# Altium project CDB-helper.PrjPCB (part 1 of 2)
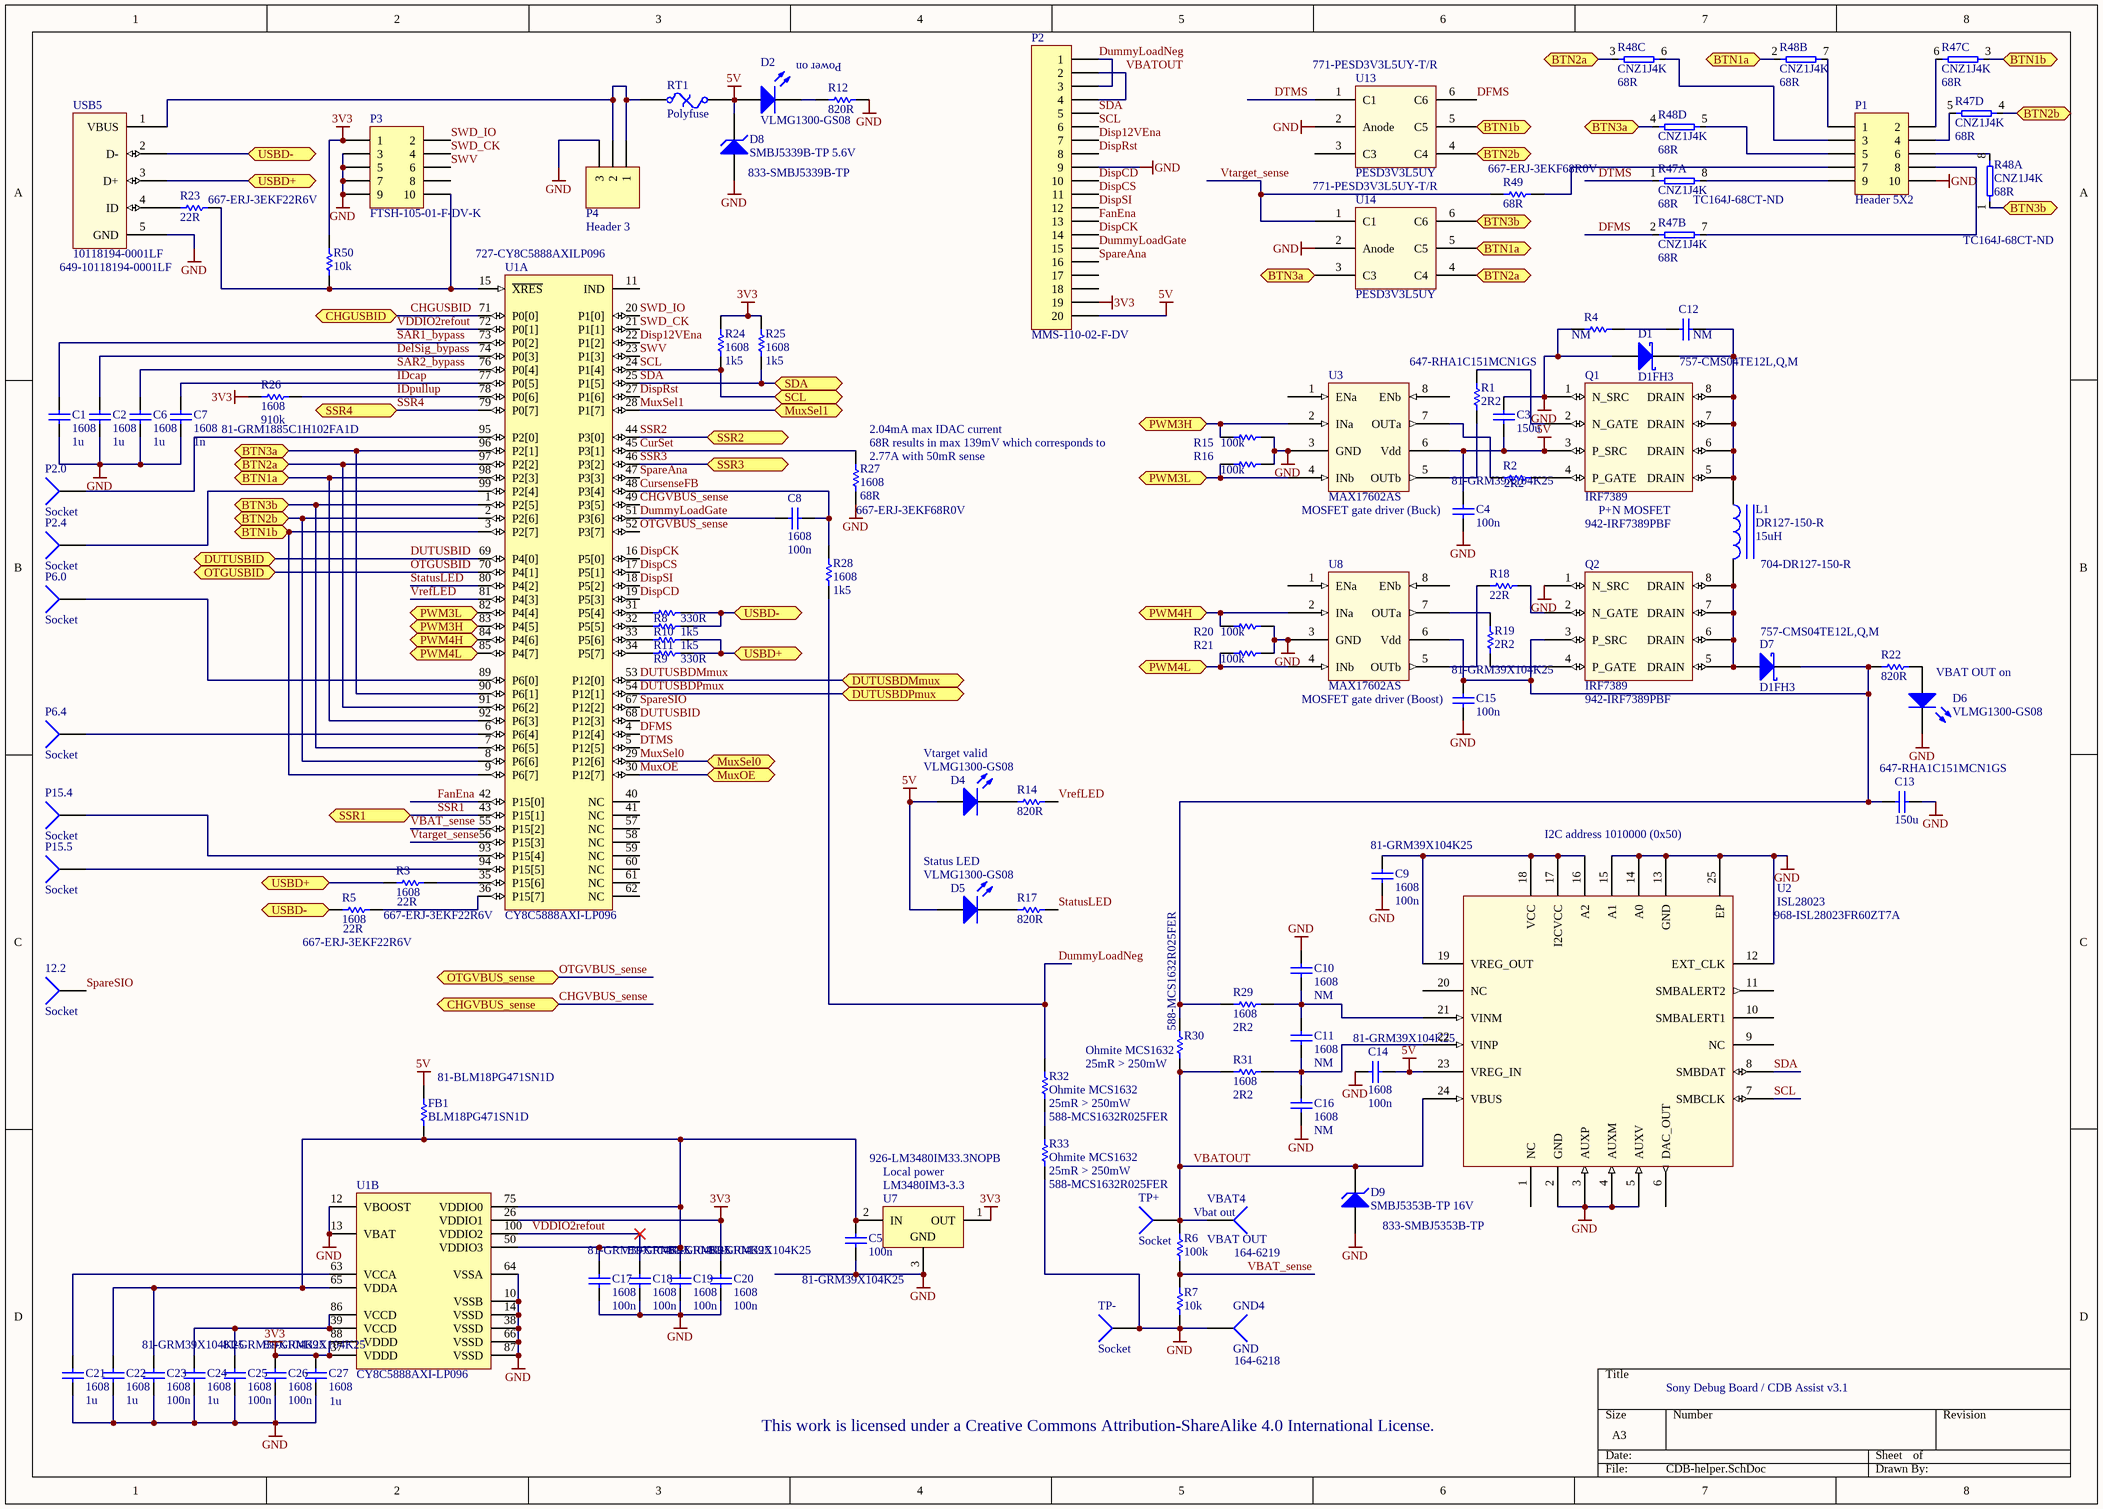
[diagram p0: CDB-helper.SchDoc]
2 sheets, 131 parts. Net scope: flat (ports and power ports of the same name join across sheets).
Board file: CDB-helper.PcbDoc
Sheets:
  CDB-helper.SchDoc
  USBSwitch.SchDoc

## Sheet CDB-helper.SchDoc
size A3; PageSetup: Record=PageOptions|CenterHorizontal=True|CenterVertical=True|PrintScale=1.42|XCorrection=1.00|YCorrection=1.00|PrintKind=0|BorderSize=5000000|LeftOffset=0|BottomOffset=0|Orientation=2|PaperLength=1000|PaperWidth=1000|Scale=100|PaperSource=7|PrintQuality=-4|MediaType=1|DitherType=10|PaperKind=Tabloid|PrintScaleMode=1

### Parts
12.2  Socket  [TP1.4mm]  (no BOM)
C1  1608  value 1u  [RESC1608N]
C2  1608  value 1u  [RESC1608N]
C3  Supplier Part Number 1: 647-RHA1C151MCN1GS  [CE-FS-8]  (hidden comment: 150u)
C4  value 100n  Supplier Part Number 1: 81-GRM39X104K25  [RESC1608N]  (hidden comment: 1608)
C5  value 100n  Supplier Part Number 1: 81-GRM39X104K25  [RESC1608N]  (hidden comment: 1608)
C6  1608  value 1u  [RESC1608N]
C7  1608  value 1n  Supplier Part Number 1: 81-GRM1885C1H102FA1D  [RESC1608N]
C8  1608  value 100n  [RESC1608N]
C9  1608  value 100n  Supplier Part Number 1: 81-GRM39X104K25  [RESC1608N]
C10  1608  value NM  [RESC1608N]
C11  1608  value NM  [RESC1608N]
C12  value NM  [RESC1608N]  (hidden comment: 1608)
C13  Supplier Part Number 1: 647-RHA1C151MCN1GS  [CE-FS-8]  (hidden comment: 150u)
C14  1608  value 100n  Supplier Part Number 1: 81-GRM39X104K25  [RESC1608N]
C15  value 100n  Supplier Part Number 1: 81-GRM39X104K25  [RESC1608N]  (hidden comment: 1608)
C16  1608  value NM  [RESC1608N]
C17  1608  value 100n  Supplier Part Number 1: 81-GRM39X104K25  [RESC1608N]
C18  1608  value 100n  Supplier Part Number 1: 81-GRM39X104K25  [RESC1608N]
C19  1608  value 100n  Supplier Part Number 1: 81-GRM39X104K25  [RESC1608N]
C20  1608  value 100n  Supplier Part Number 1: 81-GRM39X104K25  [RESC1608N]
C21  1608  value 1u  [RESC1608N]
C22  1608  value 1u  [RESC1608N]
C23  1608  value 100n  Supplier Part Number 1: 81-GRM39X104K25  [RESC1608N]
C24  1608  value 1u  [RESC1608N]
C25  1608  value 100n  Supplier Part Number 1: 81-GRM39X104K25  [RESC1608N]
C26  1608  value 100n  Supplier Part Number 1: 81-GRM39X104K25  [RESC1608N]
C27  1608  value 1u  [RESC1608N]
D1  D1FH3  Supplier Part Number 1: 757-CMS04TE12L,Q,M  [SMB]
D2  VLMG1300-GS08  [CAPC1608N]
D4  VLMG1300-GS08  [CAPC1608N]
D5  VLMG1300-GS08  [CAPC1608N]
D6  VLMG1300-GS08  [CAPC1608N]
D7  D1FH3  Supplier Part Number 1: 757-CMS04TE12L,Q,M  [SMB]
D8  SMBJ5339B-TP 5.6V  Supplier Part Number 1: 833-SMBJ5339B-TP  [SMB]
D9  SMBJ5353B-TP 16V  Supplier Part Number 1: 833-SMBJ5353B-TP  [SMB]
FB1  value BLM18PG471SN1D  Supplier Part Number 1: 81-BLM18PG471SN1D  [RESC1608N]  (hidden comment: 1608)
GND4  GND  Supplier Part Number 1: 164-6218  [4mmPlug]
L1  DR127-150-R  value 15uH  Supplier Part Number 1: 704-DR127-150-R  [DR127]
P1  Header 5X2  [HDR2X5]
P2  MMS-110-02-F-DV  [Samtec MMS 20-pin]
P2.0  Socket  [TP1.4mm]  (no BOM)
P2.4  Socket  [TP1.4mm]  (no BOM)
P3  FTSH-105-01-F-DV-K  [Samtech FTSH Cortex debug]
P4  Header 3  [HDR1X3]
P6.0  Socket  [TP1.4mm]  (no BOM)
P6.4  Socket  [TP1.4mm]  (no BOM)
P15.4  Socket  [TP1.4mm]  (no BOM)
P15.5  Socket  [TP1.4mm]  (no BOM)
Q1  IRF7389  Supplier Part Number 1: 942-IRF7389PBF  [SO-8_N]
Q2  IRF7389  Supplier Part Number 1: 942-IRF7389PBF  [SO-8_N]
R1  value 2R2  [RESC1608N]  (hidden comment: 1608)
R2  value 2R2  [RESC1608N]  (hidden comment: 1608)
R3  1608  value 22R  Supplier Part Number 1: 667-ERJ-3EKF22R6V  [RESC1608N]
R4  value NM  [RESC1608N]  (hidden comment: 1608)
R5  1608  value 22R  Supplier Part Number 1: 667-ERJ-3EKF22R6V  [RESC1608N]
R6  value 100k  [RESC1608N]  (hidden comment: 1608)
R7  value 10k  [RESC1608N]  (hidden comment: 1608)
R8  value 330R  [RESC1608N]  (hidden comment: 1608)
R9  value 330R  [RESC1608N]  (hidden comment: 1608)
R10  value 1k5  [RESC1608N]  (hidden comment: 1608)
R11  value 1k5  [RESC1608N]  (hidden comment: 1608)
R12  value 820R  [RESC1608N]  (hidden comment: 1608)
R14  value 820R  [RESC1608N]  (hidden comment: 1608)
R15  value 100k  [RESC1608N]  (hidden comment: 1608)
R16  value 100k  [RESC1608N]  (hidden comment: 1608)
R17  value 820R  [RESC1608N]  (hidden comment: 1608)
R18  value 22R  [RESC1608N]  (hidden comment: 1608)
R19  value 2R2  [RESC1608N]  (hidden comment: 1608)
R20  value 100k  [RESC1608N]  (hidden comment: 1608)
R21  value 100k  [RESC1608N]  (hidden comment: 1608)
R22  value 820R  [RESC1608N]  (hidden comment: 1608)
R23  value 22R  Supplier Part Number 1: 667-ERJ-3EKF22R6V  [RESC1608N]  (hidden comment: 1608)
R24  1608  value 1k5  [RESC1608N]
R25  1608  value 1k5  [RESC1608N]
R26  1608  value 910k  [RESC1608N]
R27  1608  value 68R  Supplier Part Number 1: 667-ERJ-3EKF68R0V  [RESC1608N]
R28  1608  value 1k5  [RESC1608N]
R29  1608  value 2R2  [RESC1608N]
R30  Ohmite MCS1632  value 25mR > 250mW  Supplier Part Number 1: 588-MCS1632R025FER  [RESC3216X06N]
R31  1608  value 2R2  [RESC1608N]
R32  Ohmite MCS1632  value 25mR > 250mW  Supplier Part Number 1: 588-MCS1632R025FER  [RESC3216X06N]
R33  Ohmite MCS1632  value 25mR > 250mW  Supplier Part Number 1: 588-MCS1632R025FER  [RESC3216X06N]
R47  CNZ1J4K  value 68R  Supplier Part Number 1: TC164J-68CT-ND  [CN1J4-3D]  (parts A,B,C,D of 4)
R48  CNZ1J4K  value 68R  Supplier Part Number 1: TC164J-68CT-ND  [CN1J4-3D]  (parts A,B,C,D of 4)
R49  value 68R  Supplier Part Number 1: 667-ERJ-3EKF68R0V  [RESC1608N]  (hidden comment: 1608)
R50  value 10k  [RESC1608N]  (hidden comment: 1608)
RT1  Polyfuse  [RESC4532N]
TP+  Socket  [PIN1]  (no BOM)
TP-  Socket  [PIN1]  (no BOM)
U1  CY8C5888AXI-LP096  Supplier Part Number 1: 727-CY8C5888AXILP096  [CYP-AX100_N]  (parts A,B of 2)
U2  ISL28023  Supplier Part Number 1: 968-ISL28023FR60ZT7A  [ISL28023]
U3  MAX17602AS  [NSO8_N]
U7  LM3480IM3-3.3  Supplier Part Number 1: 926-LM3480IM33.3NOPB  [MF03A_L]
U8  MAX17602AS  [NSO8_N]
U13  PESD3V3L5UY  Supplier Part Number 1: 771-PESD3V3L5UY-T/R  [PESD3V3L5UY]
U14  PESD3V3L5UY  Supplier Part Number 1: 771-PESD3V3L5UY-T/R  [PESD3V3L5UY]
USB5  10118194-0001LF  Supplier Part Number 1: 649-10118194-0001LF  [uUSB]
VBAT4  VBAT OUT  Supplier Part Number 1: 164-6219  [4mmPlug]

### Ports
BTN1a, BTN1b, BTN2a, BTN2b, BTN3a, BTN3b, CHGUSBID, CHGVBUS_sense, DUTUSBDMmux, DUTUSBDPmux, DUTUSBID, MuxOE, MuxSel0, MuxSel1, OTGUSBID, OTGVBUS_sense, PWM3H, PWM3L, PWM4H, PWM4L, SCL, SDA, SSR1, SSR2, SSR3, SSR4, USBD+, USBD-

### Nets
3V3: C20.1 C26.1 C27.1 P2.19 P3.1 R24.1 R25.1 R26.1 R50.2 U1.26(VDDIO1) U1.37(VDDD) U1.88(VDDD) U7.1(OUT)
5V: C3.1 C4.2 C14.2 D2.1(A) D4.1(A) D5.1(A) D8.2(K) FB1.2 P2.20 Q1.3(P_SRC) RT1.2 U2.23(VREG_IN) U3.6(Vdd)
GND: C1.2 C2.2 C3.2 C4.1 C5.2 C6.2 C7.2 C9.1 C10.1 C13.2 C14.1 C15.1 C16.2 C17.2 C18.2 C19.2 C20.2 C21.2 C22.2 C23.2 C24.2 C25.2 C26.2 C27.2 D1.1(A) D6.2(K) D8.1(A) D9.1(A) GND4.1 P1.10 P2.9 P3.3 P3.5 P3.7 P3.9 P4.3 Q1.1(N_SRC) Q2.1(N_SRC) R4.1 R7.1 R12.2 R15.2 R16.1 R20.2 R21.1 R27.2 R33.1 TP-.1 U1.10(VSSB) U1.12(VBOOST) U1.13(VBAT) U1.14(VSSD) U1.38(VSSD) U1.64(VSSA) U1.66(VSSD) U1.87(VSSD) U2.2(GND) U2.3(AUXP) U2.4(AUXM) U2.5(AUXV) U2.12(EXT_CLK) U2.13(GND) U2.14(A0) U2.15(A1) U2.25(EP) U3.3(GND) U7.3(GND) U8.3(GND) U13.2(Anode) U14.2(Anode) USB5.5(GND)
CHGUSBID: U1.71(P0[0]) ; port CHGUSBID
CHGVBUS_sense: U1.49(P3[5]) ; port CHGVBUS_sense
CursenseFB: C8.2 R28.1 U1.48(P3[4])
CurSet: R27.1 U1.45(P3[1])
DelSig_bypass: C2.1 U1.74(P0[3])
DFMS: R47.2 U1.4(P12[4]) U13.6(C6)
Disp12VEna: P2.7 U1.22(P1[2])
DispCD: P2.10 U1.19(P5[3])
DispCK: P2.14 U1.16(P5[0])
DispCS: P2.11 U1.17(P5[1])
DispRst: P2.8 U1.27(P1[6])
DispSI: P2.12 U1.18(P5[2])
DTMS: R47.1 U1.5(P12[5]) U13.1(C1)
DummyLoadGate: C8.1 P2.15 U1.51(P3[6])
DummyLoadNeg: P2.1 P2.3 R28.2 R32.1
DUTUSBDMmux: U1.53(P12[0]) ; port DUTUSBDMmux
DUTUSBDPmux: U1.54(P12[1]) ; port DUTUSBDPmux
DUTUSBID: U1.68(P12[3]) U1.69(P4[0]) ; port DUTUSBID
FanEna: P2.13 U1.42(P15[0])
IDcap: C7.1 U1.77(P0[5])
IDpullup: R26.2 U1.78(P0[6])
MuxOE: U1.30(P12[7]) ; port MuxOE
MuxSel0: U1.29(P12[6]) ; port MuxSel0
MuxSel1: U1.28(P1[7]) ; port MuxSel1
OTGUSBID: U1.70(P4[1]) ; port OTGUSBID
OTGVBUS_sense: U1.52(P3[7]) ; port OTGVBUS_sense
SAR1_bypass: C1.1 U1.73(P0[2])
SAR2_bypass: C6.1 U1.76(P0[4])
SCL: P2.6 R24.2 U1.24(P1[4]) U2.7(SMBCLK) ; port SCL
SDA: P2.5 R25.2 U1.25(P1[5]) U2.8(SMBDAT) ; port SDA
SpareAna: P2.16 U1.47(P3[3])
SpareSIO: 12.2.1 U1.67(P12[2])
SSR1: U1.43(P15[1]) ; port SSR1
SSR2: U1.44(P3[0]) ; port SSR2
SSR3: U1.46(P3[2]) ; port SSR3
SSR4: U1.79(P0[7]) ; port SSR4
StatusLED: R17.2 U1.80(P4[2])
SWD_CK: P3.4 U1.21(P1[1])
SWD_IO: P3.2 U1.20(P1[0])
SWV: P3.6 U1.23(P1[3])
VBAT_sense: R6.1 R7.2 U1.55(P15[2])
VBATOUT: D9.2(K) P2.2 P2.4 R6.2 R30.2 R31.2 TP+.1 U2.24(VBUS) VBAT4.1
VDDIO2refout: C18.1 U1.72(P0[1]) U1.100(VDDIO2)
VrefLED: R14.2 U1.81(P4[3])
Vtarget_sense: R49.2 U1.56(P15[3]) U14.1(C1)
NetC5_1: C5.1 C17.1 C19.1 C22.1 C23.1 FB1.1 U1.50(VDDIO3) U1.65(VDDA) U1.75(VDDIO0) U7.2(IN)
NetC9_2: C9.2 U2.16(A2) U2.17(I2CVCC) U2.18(VCC) U2.19(VREG_OUT)
NetC10_2: C10.2 C11.1 R29.1 U2.21(VINM)
NetC11_2: C11.2 C16.1 R31.1 U2.22(VINP)
NetC12_1: C12.1 D1.2(K) L1.1 Q1.5(DRAIN) Q1.6(DRAIN) Q1.7(DRAIN) Q1.8(DRAIN)
NetC12_2: C12.2 R4.2
NetC13_1: C13.1 C15.2 D7.2(K) Q2.3(P_SRC) R22.1 R29.2 R30.1 U8.6(Vdd)
NetC21_1: C21.1 U1.63(VCCA)
NetC24_1: C24.1 C25.1 U1.39(VCCD) U1.86(VCCD)
NetD2_2: D2.2(K) R12.1
NetD4_2: D4.2(K) R14.1
NetD5_2: D5.2(K) R17.1
NetD6_1: D6.1(A) R22.2
NetD7_1: D7.1(A) L1.2 Q2.5(DRAIN) Q2.6(DRAIN) Q2.7(DRAIN) Q2.8(DRAIN)
NetP1_1: P1.1 R48.7
NetP1_2: P1.2 R47.6
NetP1_3: P1.3 R48.6
NetP1_4: P1.4 R47.5
NetP1_5: P1.5 R48.5
NetP1_6: P1.6 R48.8
NetP1_7: P1.7 R49.1
NetP1_8: P1.8 R47.7
NetP1_9: P1.9 R47.8
NetP2.0_1: P2.0.1 U1.95(P2[0])
NetP2.4_1: P2.4.1 U1.99(P2[4])
NetP3_10: P3.10 R23.1 R50.1 U1.15(~{XRES})
NetP4_1: P4.1 P4.2 RT1.1 USB5.1(VBUS)
NetP6.0_1: P6.0.1 U1.89(P6[0])
NetP6.4_1: P6.4.1 U1.6(P6[4])
NetP15.4_1: P15.4.1 U1.93(P15[4])
NetP15.5_1: P15.5.1 U1.94(P15[5])
NetQ1_2: Q1.2(N_GATE) R1.1
NetQ1_4: Q1.4(P_GATE) R2.2
NetQ2_2: Q2.2(N_GATE) R18.2
NetQ2_4: Q2.4(P_GATE) R19.1
NetR1_2: R1.2 U3.5(OUTb)
NetR2_1: R2.1 U3.7(OUTa)
NetR3_1: R3.1 U1.35(P15[6])
NetR3_2: R3.2 R9.1 R11.1 USB5.3(D+) ; port USBD+
NetR5_1: R5.1 U1.36(P15[7])
NetR5_2: R5.2 R8.1 R10.1 USB5.2(D-) ; port USBD-
NetR8_2: R8.2 U1.31(P5[4])
NetR9_2: R9.2 U1.34(P5[7])
NetR10_2: R10.2 U1.32(P5[5])
NetR11_2: R11.2 U1.33(P5[6])
NetR15_1: R15.1 U1.83(P4[5]) U3.2(INa) ; port PWM3H
NetR16_2: R16.2 U1.82(P4[4]) U3.4(INb) ; port PWM3L
NetR18_1: R18.1 U8.5(OUTb)
NetR19_2: R19.2 U8.7(OUTa)
NetR20_1: R20.1 U1.84(P4[6]) U8.2(INa) ; port PWM4H
NetR21_2: R21.2 U1.85(P4[7]) U8.4(INb) ; port PWM4L
NetR23_2: R23.2 USB5.4(ID)
NetR32_2: R32.2 R33.2
NetR47_3: R47.3 U1.3(P2[7]) U1.9(P6[7]) U13.5(C5) ; port BTN1b
NetR47_4: R47.4 U1.2(P2[6]) U1.8(P6[6]) U13.4(C4) ; port BTN2b
NetR48_1: R48.1 U1.1(P2[5]) U1.7(P6[5]) U14.6(C6) ; port BTN3b
NetR48_2: R48.2 U1.92(P6[3]) U1.98(P2[3]) U14.5(C5) ; port BTN1a
NetR48_3: R48.3 U1.91(P6[2]) U1.97(P2[2]) U14.4(C4) ; port BTN2a
NetR48_4: R48.4 U1.90(P6[1]) U1.96(P2[1]) U14.3(C3) ; port BTN3a

Not connected (* = marked no-connect by the designer): P2 17 18; P3 8; U1 11(IND) 40(NC) 41(NC) 57(NC) 58(NC) 59(NC) 60(NC) 61(NC) 62(NC); U2 1(NC) 6(DAC_OUT) 9(NC) 10(SMBALERT1) 11(SMBALERT2) 20(NC); U3 1(ENa) 8(ENb); U8 1(ENa) 8(ENb); U13 3(C3)

### Notes on the sheet
- Power on
- (near R27) 2.04mA max IDAC current
- (near R27) 68R results in max 139mV which corresponds to
- (near R27) 2.77A with 50mR sense
- (near C4) MOSFET gate driver (Buck)
- (near Q1) P+N MOSFET
- (near C15) MOSFET gate driver (Boost)
- VBAT OUT on
- Vtarget valid
- I2C address 1010000 (0x50)
- Status LED
- Local power
- (near VBAT4) Vbat out
- Sony Debug Board / CDB Assist v3.1
- This work is licensed under a Creative Commons Attribution-ShareAlike 4.0 International License.

### Library data of the parts
C1 C2 C6 C8 C10 C11 C16 C21 C22 C24 C27 = Cap Semi: Capacitor (Semiconductor SIM Model); Published: 8-Jun-2000; LatestRevisionDate: 29-May-2009; LatestRevisionNote: IPC-7351 Footprint Added.; PackageReference: C1206; Publisher: Altium Limited; PackageDescription: Chip Capacitor
C3 C13 = Cap: Capacitor; Manufacturer: Nichicon; Manufacturer Part Number: RHA1C151MCN1GS; Capacitance: 150 uF; Tolerance: 20 %; Voltage Rating DC: 16 V; ESR: 22 mOhms; Leakage Current: 700 uA; Case Diameter: 8 mm; Case Length: 6.7 mm; Dissipation Factor DF: 0.12; Ripple Current: 3.22 A; Published: 8-Jun-2000; LatestRevisionDate: 17-Jul-2002; LatestRevisionNote: Re-released for DXP Platform.; PackageReference: RAD-0.3; Publisher: Altium Limited; PackageDescription: Radial Cap, Thru-Hole; 2 Leads; 0.3 in Pin Spacing; Value: 150u; Supplier 1: Mouser; RoHS: RoHS Compliant; Category: Aluminum Organic Polymer Capacitors; Stock 1: 12231; Pricing 1: 1=1.30, 10=0.878, 100=0.578, 500=0.520, 1000=0.359, 2000=0.335, 5000=0.318, 10000=0.307, 25000=0.281 (USD); Packaging: Reel; Product: Organic Polymer Aluminum - SMD Capacitors; Series: HA; Termination Style: SMD/SMT; Brand: Nichicon; Maximum Operating Temperature: + 105 C; Minimum Operating Temperature: - 55 C; Product Category: Functional Polymer Capacitors Radial/SMD; Product Type: Can; Standard Pack Qty: 1000; Tradename: FPCAP; RoHS - Mouser: Y; Minimum Order Quantity: 1; Reeling: True; ComponentLink1URL: http://www.mouser.com/ds/2/293/2009fpcap_catalog_hsha-28192.pdf; ComponentLink1Description: http://www.mouser.com/ds/2/293/2009fpcap_catalog_hsha-28192.pdf
C4 C5 C15 = Cap: Capacitor; Manufacturer: Murata Electronics; Manufacturer Part Number: GRM188R71E104KA01D; Capacitance: 0.1 uF; Tolerance: 10 %; Type: General Purpose MLCC; Voltage Rating DC: 25 V; Case Height: 0.8 mm; Case Length: 1.6 mm; Dielectric: X7R; Temperature Coefficient / Code: +/- 15 %; Published: 8-Jun-2000; LatestRevisionDate: 17-Jul-2002; LatestRevisionNote: Re-released for DXP Platform.; PackageReference: RAD-0.3; Publisher: Altium Limited; PackageDescription: Radial Cap, Thru-Hole; 2 Leads; 0.3 in Pin Spacing; Supplier 1: Mouser; RoHS: RoHS Compliant; Category: Multilayer Ceramic Capacitors MLCC - SMD/SMT; Stock 1: 1414567; Pricing 1: 1=0.100, 10=0.011, 100=0.007, 1000=0.005, 4000=0.004, 48000=0.003 (USD); Operating Temperature Range: - 55 C to + 125 C; Package / Case: 0603 (1608 metric); Packaging: Reel; Product: General Type MLCCs; Series: GRM; Termination Style: SMD/SMT; Brand: Murata Electronics; Case Code - in: 0603; Case Code - mm: 1608; Case Width: 0.8 mm; Maximum Operating Temperature: + 125 C; Minimum Operating Temperature: - 55 C; Product Category: Low & Medium Capacitance SMD Ceramic Chip Capacitors; Standard Pack Qty: 4000; RoHS - Mouser: Y; Minimum Order Quantity: 1; Reeling: True; ComponentLink1URL: http://www.murata.com/products/catalog/pdf/c02e.pdf; ComponentLink1Description: http://www.murata.com/products/catalog/pdf/c02e.pdf
C7 = Cap Semi: Capacitor (Semiconductor SIM Model); Manufacturer: Murata Electronics; Manufacturer Part Number: GRM1885C1H102FA01D; Capacitance: 1000 pF; Tolerance: 1 %; Type: General Purpose MLCC; Voltage Rating DC: 50 V; Case Height: 0.8 mm; Case Length: 1.6 mm; Dielectric: C0G (NP0); Temperature Coefficient / Code: +/- 30 PPM / C; Published: 8-Jun-2000; LatestRevisionDate: 29-May-2009; LatestRevisionNote: IPC-7351 Footprint Added.; PackageReference: C1206; Publisher: Altium Limited; PackageDescription: Chip Capacitor; Supplier 1: Mouser; RoHS: RoHS Compliant; Category: Multilayer Ceramic Capacitors MLCC - SMD/SMT; Stock 1: 172542; Pricing 1: 1=0.180, 10=0.074, 100=0.043, 1000=0.035, 4000=0.027, 8000=0.024, 24000=0.023, 48000=0.021, 100000=0.018 (USD); Operating Temperature Range: - 55 C to + 125 C; Package / Case: 0603 (1608 metric); Packaging: Reel; Product: General Type MLCCs; Series: GRM; Termination Style: SMD/SMT; Brand: Murata Electronics; Case Code - in: 0603; Case Code - mm: 1608; Case Width: 0.8 mm; Maximum Operating Temperature: + 125 C; Minimum Operating Temperature: - 55 C; Product Category: Low & Medium Capacitance SMD Ceramic Chip Capacitors; Standard Pack Qty: 4000; RoHS - Mouser: Y; Minimum Order Quantity: 1; Reeling: True; ComponentLink1URL: http://www.murata.com/products/catalog/pdf/c02e.pdf; ComponentLink1Description: http://www.murata.com/products/catalog/pdf/c02e.pdf
C9 C14 C17-C20 C23 C25 C26 = Cap Semi: Capacitor (Semiconductor SIM Model); Manufacturer: Murata Electronics; Manufacturer Part Number: GRM188R71E104KA01D; Capacitance: 0.1 uF; Tolerance: 10 %; Type: General Purpose MLCC; Voltage Rating DC: 25 V; Case Height: 0.8 mm; Case Length: 1.6 mm; Dielectric: X7R; Temperature Coefficient / Code: +/- 15 %; Published: 8-Jun-2000; LatestRevisionDate: 29-May-2009; LatestRevisionNote: IPC-7351 Footprint Added.; PackageReference: C1206; Publisher: Altium Limited; PackageDescription: Chip Capacitor; Supplier 1: Mouser; RoHS: RoHS Compliant; Category: Multilayer Ceramic Capacitors MLCC - SMD/SMT; Stock 1: 1414567; Pricing 1: 1=0.100, 10=0.011, 100=0.007, 1000=0.005, 4000=0.004, 48000=0.003 (USD); Operating Temperature Range: - 55 C to + 125 C; Package / Case: 0603 (1608 metric); Packaging: Reel; Product: General Type MLCCs; Series: GRM; Termination Style: SMD/SMT; Brand: Murata Electronics; Case Code - in: 0603; Case Code - mm: 1608; Case Width: 0.8 mm; Maximum Operating Temperature: + 125 C; Minimum Operating Temperature: - 55 C; Product Category: Low & Medium Capacitance SMD Ceramic Chip Capacitors; Standard Pack Qty: 4000; RoHS - Mouser: Y; Minimum Order Quantity: 1; Reeling: True; ComponentLink1URL: http://www.murata.com/products/catalog/pdf/c02e.pdf; ComponentLink1Description: http://www.murata.com/products/catalog/pdf/c02e.pdf
C12 = Cap: Capacitor; Published: 8-Jun-2000; LatestRevisionDate: 17-Jul-2002; LatestRevisionNote: Re-released for DXP Platform.; PackageReference: RAD-0.3; Publisher: Altium Limited; PackageDescription: Radial Cap, Thru-Hole; 2 Leads; 0.3 in Pin Spacing
D1 D7 = D Schottky: Schottky Diode; Manufacturer: Toshiba; Manufacturer Part Number: CMS04(TE12L,Q,M); Configuration: Single; If - Forward Current: 5 A; Ifsm - Forward Surge Current: 70 A; Ir - Reverse Current: 8000 uA; Vf - Forward Voltage: 0.37 V; Vrrm - Repetitive Reverse Voltage: 30 V; Published: 8-Jun-2000; LatestRevisionDate: 17-Jul-2002; LatestRevisionNote: Re-released for DXP Platform.; PackageReference: SMB; Publisher: Altium Limited; PackageDescription: DO-214-AA/SMB; 2 C-Bend Leads; Body 5.3 x 3.6 mm, inc. leads (LxW); Code_JEDEC: DO-214-AA; Supplier 1: Mouser; RoHS: RoHS Compliant; Category: Schottky Diodes & Rectifiers; Stock 1: 14859; Pricing 1: 1=0.820, 10=0.640, 100=0.414, 1000=0.331, 3000=0.271, 9000=0.261, 24000=0.251, 45000=0.247 (USD); Package / Case: M-FLAT; Packaging: Reel; Product: Schottky Rectifiers; Technology: Si; Brand: Toshiba; Mounting Style: SMD/SMT; Maximum Operating Temperature: + 125 C; Minimum Operating Temperature: - 40 C; Product Category: Diodes - Schottky; Standard Pack Qty: 3000; RoHS - Mouser: Y; Minimum Order Quantity: 1; Reeling: True; ComponentLink1URL: http://toshiba.semicon-storage.com/info/docget.jsp?did=3133&prodName=CMS04; ComponentLink1Description: http://toshiba.semicon-storage.com/info/docget.jsp?did=3133&prodName=CMS04
D2 D4-D6 = LED2: Typical RED, GREEN, YELLOW, AMBER GaAs LED; pin to pad: 1>2 2>1; Published: 8-Jun-2000; LatestRevisionDate: 17-Jul-2002; LatestRevisionNote: Re-released for DXP Platform.; PackageVersion: Feb-2002; PackageReference: 3.2X1.6X1.1; Publisher: Altium Limited; PackageDescription: SM LED; 2 Flat Leads; PN_DigiKey: VLMG1300-GS08CT-ND
D8 = D Zener: Zener Diode; Manufacturer: Micro Commercial Components (MCC); Configuration: Single; Voltage Regulation Accuracy: 250 mV; Zener Current: 865 mA; Maximum Reverse Leakage Current: 1 uA; Pd - Power Dissipation: 5 W; Voltage Tolerance: 5 %; Zz - Zener Impedance: 1 Ohms; Published: 8-Jun-2000; LatestRevisionDate: 17-Jul-2002; LatestRevisionNote: Re-released for DXP Platform.; PackageReference: DIODE-0.7; Publisher: Altium Limited; PackageDescription: Diode, Thru-Hole; 2 Leads; 0.7 in Pin Spacing; Supplier 1: Mouser; Manufacturer Part Number: SMBJ5339B-TP; RoHS: RoHS Compliant; Category: Zener Diodes; Stock 1: 10487; Pricing 1: 1=0.800, 10=0.620, 100=0.400, 1000=0.290, 3000=0.270, 9000=0.260, 24000=0.250, 45000=0.246 (USD); Package / Case: DO-214AA; Packaging: Reel; Series: SMBJ5339B; Brand: Micro Commercial Components (MCC); Mounting Style: SMD/SMT; Maximum Operating Temperature: + 150 C; Minimum Operating Temperature: - 55 C; Product Category: Diodes - Zener; Standard Pack Qty: 3000; Vz - Zener Voltage: 5.6 V; RoHS - Mouser: Y; Minimum Order Quantity: 1; Reeling: True; ComponentLink1URL: http://www.mouser.com/ds/2/258/LDS-0246-2-471137.pdf; ComponentLink1Description: http://www.mouser.com/ds/2/258/LDS-0246-2-471137.pdf
D9 = D Zener: Zener Diode; Manufacturer: Micro Commercial Components (MCC); Configuration: Single; Voltage Regulation Accuracy: 300 mV; Zener Current: 295 mA; Maximum Reverse Leakage Current: 1 uA; Pd - Power Dissipation: 5 W; Voltage Tolerance: 5 %; Zz - Zener Impedance: 2.5 Ohms; Published: 8-Jun-2000; LatestRevisionDate: 17-Jul-2002; LatestRevisionNote: Re-released for DXP Platform.; PackageReference: DIODE-0.7; Publisher: Altium Limited; PackageDescription: Diode, Thru-Hole; 2 Leads; 0.7 in Pin Spacing; Supplier 1: Mouser; Manufacturer Part Number: SMBJ5353B-TP; RoHS: RoHS Compliant; Category: Zener Diodes; Stock 1: 190; Pricing 1: 1=0.630, 10=0.490, 100=0.316, 1000=0.229, 3000=0.213, 9000=0.205, 24000=0.198, 45000=0.194 (USD); Package / Case: DO-214AA; Packaging: Reel; Series: SMBJ5353B; Brand: Micro Commercial Components (MCC); Mounting Style: SMD/SMT; Maximum Operating Temperature: + 150 C; Minimum Operating Temperature: - 55 C; Product Category: Diodes - Zener; Standard Pack Qty: 3000; Vz - Zener Voltage: 16 V; RoHS - Mouser: Y; Minimum Order Quantity: 1; Reeling: True; ComponentLink1URL: http://www.mouser.com/ds/2/258/SMBJ5338B-SMBJ5388B(SMB)-276685.pdf; ComponentLink1Description: http://www.mouser.com/ds/2/258/SMBJ5338B-SMBJ5388B(SMB)-276685.pdf
FB1 = Res1: Resistor; Manufacturer: Murata Electronics; Impedance: 470 Ohms; Maximum DC Current: 1 A; Maximum DC Resistance: 200 mOhms; Tolerance: 25 %; Case Height: 0.8 mm; Case Length: 1.6 mm; Test Frequency: 100 MHz; Published: 8-Jun-2000; LatestRevisionDate: 17-Jul-2002; LatestRevisionNote: Re-released for DXP Platform.; PackageReference: AXIAL-0.3; Publisher: Altium Limited; PackageDescription: Axial Device, Thru-Hole; 2 Leads; 0.3 in Pin Spacing; Supplier 1: Mouser; Manufacturer Part Number: BLM18PG471SN1D; RoHS: RoHS Compliant; Category: EMI Filter Beads, Chips & Arrays; Stock 1: 70524; Pricing 1: 1=0.110, 10=0.068, 100=0.033, 1000=0.028, 4000=0.022, 8000=0.020, 24000=0.018, 100000=0.017 (USD); Capacitance: -; Dimensions: 0.8 mm W x 1.6 mm L x 0.8 mm H; Operating Temperature Range: - 55 C to + 125 C; Package / Case: 0603 (1608 metric); Packaging: Reel; Product: Ferrite Chip Beads; Termination Style: SMD/SMT; Brand: Murata Electronics; Case Width: 0.8 mm; Product Category: SMD EMI Filters/Chip Ferrite Beads; Standard Pack Qty: 4000; RoHS - Mouser: Y; Minimum Order Quantity: 1; Reeling: True; ComponentLink1URL: http://search.murata.co.jp/Ceramy/CatalogAction.do?sHinnm=?&nbsp&sNHinnm=BLM18PG471SN1D&sNhin_key=BLM18PG471SN1D&sLang=en; ComponentLink1Description: http://search.murata.co.jp/Ceramy/CatalogAction.do?sHinnm=?&nbsp&sNHinnm=BLM18PG471SN1D&sNhin_key=BLM18PG471SN1D&sLang=en
GND4 = Socket: Manufacturer: Deltron; Manufacturer Part Number: 571-0100; Current Rating: 10 A; Description/Function: 90 degree single insulated 4mm socket, for direct mounting onto PCB; Voltage Rating: 250 V; Equipment Type: PCB; Positions/Sockets: 1; LatestRevisionDate: 17-Jul-2002; LatestRevisionNote: Re-released for DXP Platform.; Publisher: Altium Limited; Supplier 1: Mouser; RoHS: RoHS Compliant; Category: Test Sockets; Stock 1: 12201; Pricing 1: 1=1.74, 10=1.45, 25=1.32, 50=1.20, 100=1.09, 200=0.990, 500=0.906, 1000=0.877, 2000=0.793 (USD); Color: Black; Contact Plating: Silver; Insulation Material: Acetal; Length: 23.3 mm; Operating Temperature Range: - 25 C to + 110 C; Brand: Deltron; Contact Material: Brass; Product Category: 4mm Connectors; RoHS - Mouser: Y; Minimum Order Quantity: 1; Reeling: False; ComponentLink1URL: http://www.mouser.com/ds/2/458/deltron-571-0100-4mm-90deg-single-socket-data-372703.pdf; ComponentLink1Description: http://www.mouser.com/ds/2/458/deltron-571-0100-4mm-90deg-single-socket-data-372703.pdf
L1 = Inductor Iron: Magnetic-Core Inductor; Manufacturer: Coiltronics / Eaton; Core Material: Ferrite; Inductance: 15 uH; Maximum DC Current: 9.66 A; Maximum DC Resistance: 24.7 mOhms; Shielding: Shielded; Tolerance: 20 %; Case Height: 8 mm; Case Length: 12.5 mm; Published: 24-Mar-1999; LatestRevisionDate: 17-Jul-2002; LatestRevisionNote: Re-released for DXP Platform.; PackageReference: AXIAL-0.9; Publisher: Altium Limited; Supplier 1: Mouser; Manufacturer Part Number: DR127-150-R; RoHS: RoHS Compliant; Category: Fixed Inductors; Stock 1: 6562; Pricing 1: 1=1.99, 50=1.56, 100=1.37, 350=1.01, 1050=0.900, 2450=0.795, 5250=0.770, 8050=0.750 (USD); Operating Temperature Range: - 40 C to + 125 C; Packaging: Reel; Product: Power Inductors; Series: DR; Termination Style: SMD/SMT; Brand: Coiltronics / Eaton; Case Width: 12.5 mm; Product Category: SMD Low Profile Power Inductors; Standard Pack Qty: 350; RoHS - Mouser: Y; Minimum Order Quantity: 1; Reeling: True; ComponentLink1URL: http://www.mouser.com/ds/2/87/Bus_Elx_DS_4315_DR_Series-248110.pdf; ComponentLink1Description: http://www.mouser.com/ds/2/87/Bus_Elx_DS_4315_DR_Series-248110.pdf
P1 = Header 5X2: Header, 5-Pin, Dual row; LatestRevisionDate: 17-Jul-2002; LatestRevisionNote: Re-released for DXP Platform.; Publisher: Altium Limited
P2 = Header 20: Header, 20-Pin; LatestRevisionDate: 17-Jul-2002; LatestRevisionNote: Re-released for DXP Platform.; Publisher: Altium Limited
P3 = MHDR2X5: Header, 5-Pin, Dual row; LatestRevisionDate: 17-Jul-2002; LatestRevisionNote: Re-released for DXP Platform.; Publisher: Altium Limited
P4 = Header 3: Header, 3-Pin; LatestRevisionDate: 17-Jul-2002; LatestRevisionNote: Re-released for DXP Platform.; Publisher: Altium Limited
Q1 Q2 = IRF7389: Manufacturer: International Rectifier; Manufacturer Part Number: IRF7389PBF; Configuration: Dual Dual Drain; Forward Transconductance - Min: 14 S; Transistor Polarity: N and P-Channel; Channel Mode: Enhancement; Fall Time: 17 ns, 32 ns; Id - Continuous Drain Current: 7.3 A; Pd - Power Dissipation: 2.5 W; Qg - Gate Charge: 22 nC; Rds On - Drain-Source Resistance: 58 mOhms; Rise Time: 8.9 ns, 13 ns; Typical Turn-Off Delay Time: 26 ns, 34 ns; Vds - Drain-Source Breakdown Voltage: 30 V; Vgs - Gate-Source Breakdown Voltage: 20 V; Vgs th - Gate-Source Threshold Voltage: - 1 V, 1 V; Supplier 1: Mouser; RoHS: RoHS Compliant; Category: MOSFET; Stock 1: 2793; Pricing 1: 1=1.27, 10=0.641, 100=0.539, 500=0.509, 1000=0.477, 2500=0.439, 10000=0.418, 25000=0.403 (USD); Package / Case: SOIC-8; Packaging: Tube; Brand: International Rectifier; Mounting Style: SMD/SMT; Maximum Operating Temperature: + 150 C; Minimum Operating Temperature: - 55 C; Standard Pack Qty: 95; RoHS - Mouser: Y; Minimum Order Quantity: 1; Reeling: False; ComponentLink1URL: http://www.mouser.com/ds/2/200/irf7389pbf-221980.pdf; ComponentLink1Description: http://www.mouser.com/ds/2/200/irf7389pbf-221980.pdf
R1 R2 R4 R6-R12 R14-R22 R50 = Res1: Resistor; Published: 8-Jun-2000; LatestRevisionDate: 17-Jul-2002; LatestRevisionNote: Re-released for DXP Platform.; PackageReference: AXIAL-0.3; Publisher: Altium Limited; PackageDescription: Axial Device, Thru-Hole; 2 Leads; 0.3 in Pin Spacing
R3 R5 = Res Semi: Semiconductor Resistor; Manufacturer: Panasonic; Manufacturer Part Number: ERJ-3EKF22R6V; Power Rating: 100 mW; Resistance: 22.6 Ohms; Tolerance: 1 %; Voltage Rating: 75 V; Case Height: 0.45 mm; Case Length: 1.6 mm; Case Width: 0.8 mm; Published: 8-Jun-2000; LatestRevisionDate: 17-Jul-2002; LatestRevisionNote: Re-released for DXP Platform.; PackageReference: AXIAL-0.5; Publisher: Altium Limited; PackageDescription: Axial Device, Thru-Hole; 2 Leads; 0.5 in Pin Spacing; Supplier 1: Mouser; RoHS: RoHS Compliant By Exemption; Category: Thick Film Resistors - SMD; Stock 1: 83400; Pricing 1: 1=0.100, 10=0.015, 100=0.006, 1000=0.004, 5000=0.002 (USD); Operating Temperature Range: - 55 C to + 155 C; Package / Case: 0603 (1608 metric); Packaging: Reel; Product: Thick Film Resistors SMD; Series: ERJ; Type: Precision Thick Film Resistors SMD; Brand: Panasonic; Case Code - in: 0603; Case Code - mm: 1608; Standard Pack Qty: 5000; RoHS - Mouser: E; Minimum Order Quantity: 1; Reeling: True; ComponentLink1URL: http://industrial.panasonic.com/www-data/pdf/AOA0000/AOA0000CE2.pdf; ComponentLink1Description: http://industrial.panasonic.com/www-data/pdf/AOA0000/AOA0000CE2.pdf
R23 = Res1: Resistor; Manufacturer: Panasonic; Manufacturer Part Number: ERJ-3EKF22R6V; Power Rating: 100 mW; Resistance: 22.6 Ohms; Tolerance: 1 %; Voltage Rating: 75 V; Case Height: 0.45 mm; Case Length: 1.6 mm; Case Width: 0.8 mm; Published: 8-Jun-2000; LatestRevisionDate: 17-Jul-2002; LatestRevisionNote: Re-released for DXP Platform.; PackageReference: AXIAL-0.3; Publisher: Altium Limited; PackageDescription: Axial Device, Thru-Hole; 2 Leads; 0.3 in Pin Spacing; Supplier 1: Mouser; RoHS: RoHS Compliant By Exemption; Category: Thick Film Resistors - SMD; Stock 1: 83400; Pricing 1: 1=0.100, 10=0.015, 100=0.006, 1000=0.004, 5000=0.002 (USD); Operating Temperature Range: - 55 C to + 155 C; Package / Case: 0603 (1608 metric); Packaging: Reel; Product: Thick Film Resistors SMD; Series: ERJ; Type: Precision Thick Film Resistors SMD; Brand: Panasonic; Case Code - in: 0603; Case Code - mm: 1608; Standard Pack Qty: 5000; RoHS - Mouser: E; Minimum Order Quantity: 1; Reeling: True; ComponentLink1URL: http://industrial.panasonic.com/www-data/pdf/AOA0000/AOA0000CE2.pdf; ComponentLink1Description: http://industrial.panasonic.com/www-data/pdf/AOA0000/AOA0000CE2.pdf
R24 R25 R28 R29 R31 = Res Semi: Semiconductor Resistor; Published: 8-Jun-2000; LatestRevisionDate: 17-Jul-2002; LatestRevisionNote: Re-released for DXP Platform.; PackageReference: AXIAL-0.5; Publisher: Altium Limited; PackageDescription: Axial Device, Thru-Hole; 2 Leads; 0.5 in Pin Spacing
R26 = Res Semi: Semiconductor Resistor; Manufacturer: Panasonic Electronic Components; Manufacturer Part Number: ERJ-3EKF1004V; Resistance (Ohms): 1M; Tolerance: ±1%; Power (Watts): 0.1W, 1/10W; Temperature Coefficient: ±100ppm/°C; Published: 8-Jun-2000; LatestRevisionDate: 17-Jul-2002; LatestRevisionNote: Re-released for DXP Platform.; PackageReference: AXIAL-0.5; Publisher: Altium Limited; PackageDescription: Axial Device, Thru-Hole; 2 Leads; 0.5 in Pin Spacing; Supplier 1: Digi-Key; Supplier Part Number 1: P1.00MHCT-ND; RoHS: RoHS Compliant; Category: Resistors; Stock 1: 781768; Pricing 1: 1=0.1, 50=0.015, 100=0.0114, 250=0.00844, 500=0.00624, 1000=0.00416, 2500=0.00351 (USD); Packaging: Cut Tape (CT); Composition: Thick Film; Features: Automotive AEC-Q200; Operating Temperature: -55°C ~ 155°C; Package / Case: 0603 (1608 Metric); Supplier Device Package: 0603; Size / Dimension: 0.063" L x 0.031" W (1.60mm x 0.80mm); Height: 0.022" (0.55mm); Number of Terminations: 2; ComponentLink1URL: http://industrial.panasonic.com/www-cgi/jvcr13pz.cgi?E+PZ+3+AOA0002+ERJ3EKF1004V+7+WW; ComponentLink1Description: http://industrial.panasonic.com/www-cgi/jvcr13pz.cgi?E+PZ+3+AOA0002+ERJ3EKF1004V+7+WW
R27 = Res Semi: Semiconductor Resistor; Manufacturer: Panasonic; Manufacturer Part Number: ERJ-3EKF68R0V; Power Rating: 100 mW; Resistance: 68 Ohms; Tolerance: 1 %; Voltage Rating: 75 V; Case Height: 0.45 mm; Case Length: 1.6 mm; Case Width: 0.8 mm; Published: 8-Jun-2000; LatestRevisionDate: 17-Jul-2002; LatestRevisionNote: Re-released for DXP Platform.; PackageReference: AXIAL-0.5; Publisher: Altium Limited; PackageDescription: Axial Device, Thru-Hole; 2 Leads; 0.5 in Pin Spacing; Supplier 1: Mouser; RoHS: RoHS Compliant By Exemption; Category: Thick Film Resistors - SMD; Stock 1: 159748; Pricing 1: 1=0.100, 10=0.015, 100=0.008, 500=0.006, 1000=0.004, 5000=0.002 (USD); Operating Temperature Range: - 55 C to + 155 C; Package / Case: 0603 (1608 metric); Packaging: Reel; Product: Thick Film Resistors SMD; Series: ERJ; Type: Precision Thick Film Resistors SMD; Brand: Panasonic; Case Code - in: 0603; Case Code - mm: 1608; Standard Pack Qty: 5000; RoHS - Mouser: E; Minimum Order Quantity: 1; Reeling: True; ComponentLink1URL: http://industrial.panasonic.com/www-data/pdf/AOA0000/AOA0000CE2.pdf; ComponentLink1Description: http://industrial.panasonic.com/www-data/pdf/AOA0000/AOA0000CE2.pdf
R30 R32 R33 = Res Semi: Semiconductor Resistor; Manufacturer Part Number: MCS1632R025FER; Power Rating: 1 W; Resistance: 0.025 Ohms; Temperature Coefficient: 50 PPM / C; Tolerance: 1 %; Voltage Rating: 220 mV; Case Height: 0.6 mm; Case Length: 3.2 mm; Case Width: 1.6 mm; Published: 8-Jun-2000; LatestRevisionDate: 17-Jul-2002; LatestRevisionNote: Re-released for DXP Platform.; PackageReference: AXIAL-0.5; Publisher: Altium Limited; PackageDescription: Axial Device, Thru-Hole; 2 Leads; 0.5 in Pin Spacing; Supplier 1: Mouser; Manufacturer: Ohmite; RoHS: RoHS Compliant; Category: Current Sense Resistors - SMD; Stock 1: 6607; Pricing 1: 1=0.570, 10=0.474, 25=0.366, 100=0.319, 250=0.285, 500=0.231, 1000=0.187, 5000=0.168 (USD); Operating Temperature Range: - 25 C to + 125 C; Package / Case: 0612 (1632 metric) Reversed; Packaging: Reel; Product: Metal Element Current Sensing Resistors; Series: MCS; Termination Style: SMD/SMT; Brand: Ohmite; Case Code - in: 0612 (Reversed); Case Code - mm: 1632 (Reversed); Product Category: Current Sense Resistors; Standard Pack Qty: 5000; RoHS - Mouser: Y; Minimum Order Quantity: 1; Reeling: True; ComponentLink1URL: http://www.mouser.com/ds/2/303/mcs-14321.pdf; ComponentLink1Description: http://www.mouser.com/ds/2/303/mcs-14321.pdf
R47 R48 = CNZ1J4K: Isolated Resistor Network - Parts; Manufacturer: Yageo; Manufacturer Part Number: TC164-JR-0768RL; Sim Note: Enter the Resistance value into parameter field.; Resistance (Ohms): 68; Tolerance: ±5%; Number of Resistors: 4; Power Per Element: 62.5mW; Temperature Coefficient: ±200ppm/°C; Published: 5-apr-2007; LatestRevisionDate: 5-apr-2007; PackageReference: CNZ1J4; Publisher: Rådhuset i Växjö HB; Supplier 1: Digi-Key; RoHS: RoHS Compliant; Category: Resistors; Stock 1: 33485; Pricing 1: 1=0.1, 10=0.057, 25=0.0416, 100=0.0234, 250=0.01784, 500=0.01426, 1000=0.01049, 2500=0.00911 (USD); Packaging: Cut Tape (CT); Circuit Type: Isolated; Number of Pins: 8; Operating Temperature: -55°C ~ 155°C; Applications: -; Mounting Type: Surface Mount; Package / Case: 1206 (3216 Metric), Concave, Long Side Terminals; Supplier Device Package: 0603; Size / Dimension: 0.126" L x 0.063" W (3.20mm x 1.60mm); Height: 0.028" (0.70mm); ComponentLink1URL: http://www.yageo.com/documents/recent/PYu-YC_TC164_51_RoHS_L_(3).pdf; ComponentLink1Description: http://www.yageo.com/documents/recent/PYu-YC_TC164_51_RoHS_L_(3).pdf
R49 = Res1: Resistor; Manufacturer: Panasonic; Manufacturer Part Number: ERJ-3EKF68R0V; Power Rating: 100 mW; Resistance: 68 Ohms; Tolerance: 1 %; Voltage Rating: 75 V; Case Height: 0.45 mm; Case Length: 1.6 mm; Case Width: 0.8 mm; Published: 8-Jun-2000; LatestRevisionDate: 17-Jul-2002; LatestRevisionNote: Re-released for DXP Platform.; PackageReference: AXIAL-0.3; Publisher: Altium Limited; PackageDescription: Axial Device, Thru-Hole; 2 Leads; 0.3 in Pin Spacing; Supplier 1: Mouser; RoHS: RoHS Compliant By Exemption; Category: Thick Film Resistors - SMD; Stock 1: 159748; Pricing 1: 1=0.100, 10=0.015, 100=0.008, 500=0.006, 1000=0.004, 5000=0.002 (USD); Operating Temperature Range: - 55 C to + 155 C; Package / Case: 0603 (1608 metric); Packaging: Reel; Product: Thick Film Resistors SMD; Series: ERJ; Type: Precision Thick Film Resistors SMD; Brand: Panasonic; Case Code - in: 0603; Case Code - mm: 1608; Standard Pack Qty: 5000; RoHS - Mouser: E; Minimum Order Quantity: 1; Reeling: True; ComponentLink1URL: http://industrial.panasonic.com/www-data/pdf/AOA0000/AOA0000CE2.pdf; ComponentLink1Description: http://industrial.panasonic.com/www-data/pdf/AOA0000/AOA0000CE2.pdf
RT1 = Fuse Thermal: Thermal Fuse; Published: 24-Mar-1999; LatestRevisionDate: 17-Jul-2002; LatestRevisionNote: Re-released for DXP Platform.; PackageReference: PIN-W2/E2.8; Publisher: Altium Limited; PackageDescription: Thru-Hole; 2 Leads
U1 = CY8C5888AXI-LP096: PSoC Programmable System-on-Chip, 256 KB Flash, 62 GPIOs, 1.71 to 5.5 V, 100-Pin TQFP (AX100), Tray; Manufacturer: Cypress; CPU Core: ARM Cortex-M3; Flash (KB): 256; Max. Operating Frequency (MHz): 80; Max. Operating Voltage (V): 5.5; Min. Operating Voltage (V): 1.71; No. of GPIOs: 62; SRAM (KB): 64; A/D Bit Size: 12 bit; A/D Channels Available: 2; Brand: Cypress Semiconductor; Data RAM Size: 64 kB; Data RAM Type: SRAM; Interface Type: CAN, I2C, I2S, LIN, SPI, UART, USB; Number of I/Os: 62 I/O; Program Memory Size: 256 kB; Core: ARM Cortex M3; Data Bus Width: 32 bit; Development Kit: CY8CKIT-050; Maximum Clock Frequency: 80 MHz; Number of Timers: 4 Timer; On-Chip DAC: With DAC; Operating Supply Voltage: 5.5 V; Processor Series: CY8C58LP; Product Status: New Product; DatasheetVersion: Rev. *E; PackageVersion: Rev. *D, 12/2009; PackageReference: AX100; PackageDescription: 100-Pin Thin Plastic Quad Flatpack, Body 14 x14 mm, Pitch 0.5 mm; Max. Operating Temp. (degreesC): 85; Min. Operating Temp. (degreesC): -40; Packing: Tray; Mounting Technology: Surface Mount; Code_JEDEC: MS-026; PartNumber: CY8C5888AXI-LP096; ComponentLink1Description: Manufacturer URL; ComponentLink1URL: http://www.cypress.com/; ComponentLink2Description: Datasheet; ComponentLink2URL: http://www.cypress.com/?docID=47570; ComponentLink3Description: Package Specification; ComponentLink3URL: http://www.cypress.com/?docID=45180; Supplier 1: Mouser; Manufacturer Part Number: CY8C5888AXI-LP096; RoHS: RoHS Compliant; Category: ARM Microcontrollers - MCU; Stock 1: 140; Pricing 1: 1=20.66, 5=19.62, 10=17.55, 25=16.52, 50=15.75, 100=15.49, 250=14.46, 500=13.43 (USD); Package / Case: TQFP-100; Packaging: Tray; Program Memory Type: Flash; Series: CY8C58LPxx; Mounting Style: SMD/SMT; Maximum Operating Temperature: + 85 C; Minimum Operating Temperature: - 40 C; Tradename: PSoC 5LP; RoHS - Mouser: Y; Minimum Order Quantity: 1; Reeling: False; ComponentLink4URL: http://www.mouser.com/ds/2/100/Cypress_CY8C58LP_001-84932_0F-491909.pdf; ComponentLink4Description: http://www.mouser.com/ds/2/100/Cypress_CY8C58LP_001-84932_0F-491909.pdf
U2 = ISL28023: Manufacturer: Intersil; Manufacturer Part Number: ISL28023FR60Z-T7A; Accuracy: 0.05 %; Output Current: 1 mA; Sensing Method: High or Low Side; Supply Current: 1.2 mA; Input Voltage Range: 0 V to 60 V; Development Kit: ISL28023EVKIT1Z; Supply Voltage - Max: 5.5 V; Supply Voltage - Min: 3 V; Product Status: New at Mouser; Supplier 1: Mouser; RoHS: RoHS Compliant; Category: Current & Power Monitors & Regulators; Stock 1: 489; Pricing 1: 1=4.98, 25=4.05, 100=3.44, 250=2.83, 500=2.31 (USD); Operating Temperature Range: - 40 C to + 125 C; Package / Case: QFN-24; Packaging: Tube; Product: Power Monitors; Series: ISL28023; Brand: Intersil; Mounting Style: SMD/SMT; RoHS - Mouser: Y; Minimum Order Quantity: 1; Reeling: False; ComponentLink1URL: http://www.mouser.com/ds/2/465/isl28023-364245.pdf; ComponentLink1Description: http://www.mouser.com/ds/2/465/isl28023-364245.pdf
U7 = LM3480IM3-3.3: 100 mA, Quasi Low-Dropout Linear Voltage Regulator, 3-pin SOT-23; Manufacturer: National Semiconductor; Manufacturer Part Number: LM3480IM3-3.3/NOPB; PackageTopMarking: L0A*XTT; PowerWise: N; CompType: LDO IC; Input Voltage MAX: 30 V; Number of Outputs: 1 Output; Output Current: 0.1 A; Output Type: Fixed; Output Voltage: 3.3 V; Brand: Texas Instruments; Dropout Voltage - Max: 0.9 V at 10 mA, 1.1 V at 100 mA; Voltage Regulation Accuracy: +/- 5 %; Line Regulation: 10 mV; Load Regulation: 20 mV; Maximum Power Dissipation: 250 mW; Published: 4-Dec-2008; DatasheetVersion: Mar-2005; PackageVersion: revB, Mar-2003; PackageReference: MF03A; Publisher: Altium Limited; PackageDescription: Molded SOT-23, .115 x .051 x .037in Body, 3 Lead, .075 in Pitch; PartNumber: LM3480IM3-3.3; RoHS: N; PinCount: 3; ComponentLink1Description: LM3480 Datasheet; ComponentLink1URL: http://www.national.com/ds/LM/LM3480.pdf; ComponentLink2Description: LM3480 Web Page; ComponentLink2URL: http://www.national.com/pf/LM/LM3480.html; ComponentLink3Description: MF03A Package Page; ComponentLink3URL: http://www.national.com/packaging/folders/mf03a.html; Supplier 1: Mouser; Category: LDO Voltage Regulators; Stock 1: 17825; Pricing 1: 1=0.970, 10=0.862, 25=0.777, 50=0.720, 100=0.680, 250=0.581, 500=0.513, 750=0.448, 1000=0.338 (USD); Package / Case: SOT-23; Packaging: Reel; Product: Quasi Low-Dropout Linear Voltage Regulator; Series: LM3480; Type: Integrated Linear Voltage Regulator; Mounting Style: SMD/SMT; Maximum Operating Temperature: + 125 C; Minimum Operating Temperature: - 40 C; Standard Pack Qty: 1000; RoHS - Mouser: Y; Minimum Order Quantity: 1; Reeling: True; ComponentLink4URL: http://www.mouser.com/ds/2/405/snvs011g-532079.pdf; ComponentLink4Description: http://www.mouser.com/ds/2/405/snvs011g-532079.pdf
U13 U14 = Component_1: Manufacturer: NXP Semiconductors; Manufacturer Part Number: PESD3V3L5UY,115; Breakdown Voltage: 5.6 V; Capacitance: 22 pF; Clamping Voltage: 12 V; Operating Voltage: 3.3 V; Channels: 5 Channel; Peak Surge Current: 2.5 A; Peak Pulse Power Dissipation: 25 W; Polarity: Unidirectional; Supplier 1: Mouser; RoHS: RoHS Compliant; Category: TVS Diode Arrays; Stock 1: 3219; Pricing 1: 1=0.560, 10=0.370, 100=0.267, 1000=0.220, 3000=0.188, 9000=0.170, 24000=0.166, 45000=0.162 (USD); Dimensions: 1.35(Max) mm W x 2.2(Max) mm L; Package / Case: SC-88; Packaging: Reel; Series: PESDxL5U; Termination Style: SMD/SMT; Brand: NXP Semiconductors; Mounting Style: SMD/SMT; Maximum Operating Temperature: + 150 C; Minimum Operating Temperature: - 65 C; Product Category: TVS - Zeners; Standard Pack Qty: 3000; RoHS - Mouser: Y; Minimum Order Quantity: 1; Reeling: True; ComponentLink1URL: http://www.mouser.com/ds/2/302/PESDXL5UF_V_Y-352488.pdf; ComponentLink1Description: http://www.mouser.com/ds/2/302/PESDXL5UF_V_Y-352488.pdf
USB5 = uUSB: Manufacturer: FCI; Connector Type: Micro USB Type B receptacle; Current Rating: 1.8 A; Gender: Female; Mounting Angle: Right; Number of Contacts: 5; Insulation Resistance: 1000 MOhms; PN_DigiKey: 609-4618-1-ND; Supplier 1: Mouser; Manufacturer Part Number: 10118194-0001LF; RoHS: RoHS Compliant; Category: USB Connectors; Stock 1: 43615; Pricing 1: 1=0.460, 10=0.316, 100=0.273, 500=0.260, 1200=0.197, 2400=0.180, 4800=0.158, 9600=0.152, 24000=0.147 (USD); Color: Black; Contact Plating: Gold; Operating Temperature Range: - 55 C to + 85 C; Packaging: Reel; Product: Micro USB Type B Connectors; Termination Style: SMD; Brand: FCI; Contact Material: Copper Alloy; Flammability Rating: UL 94 V-0; Standard: USB 2.0; Standard Pack Qty: 1200; RoHS - Mouser: Y; Minimum Order Quantity: 1; Reeling: True; ComponentLink1URL: http://www.mouser.com/ds/2/154/10118194AC-197217.pdf; ComponentLink1Description: http://www.mouser.com/ds/2/154/10118194AC-197217.pdf
VBAT4 = Socket: Manufacturer: Deltron; Manufacturer Part Number: 571-0500; Current Rating: 10 A; Description/Function: 90 degree single insulated 4mm socket, for direct mounting onto PCB; Voltage Rating: 250 V; Equipment Type: PCB; Positions/Sockets: 1; LatestRevisionDate: 17-Jul-2002; LatestRevisionNote: Re-released for DXP Platform.; Publisher: Altium Limited; Supplier 1: Mouser; RoHS: RoHS Compliant; Category: Test Sockets; Stock 1: 9108; Pricing 1: 1=2.06, 10=1.72, 100=1.57, 500=1.42, 1000=1.29, 2000=1.18, 5000=1.07, 10000=1.03 (USD); Color: Red; Contact Plating: Silver; Insulation Material: Acetal; Length: 23.3 mm; Operating Temperature Range: - 25 C to + 110 C; Brand: Deltron; Contact Material: Brass; Product Category: 4mm Connectors; Standard Pack Qty: 100; RoHS - Mouser: Y; Minimum Order Quantity: 1; Reeling: False; ComponentLink1URL: http://www.mouser.com/ds/2/458/deltron-571-0500-4mm-90deg-single-socket-data-372654.pdf; ComponentLink1Description: http://www.mouser.com/ds/2/458/deltron-571-0500-4mm-90deg-single-socket-data-372654.pdf
12.2 P2.0 P2.4 P6.0 P6.4 P15.4 P15.5 TP+ TP- = Socket: LatestRevisionDate: 17-Jul-2002; LatestRevisionNote: Re-released for DXP Platform.; Publisher: Altium Limited